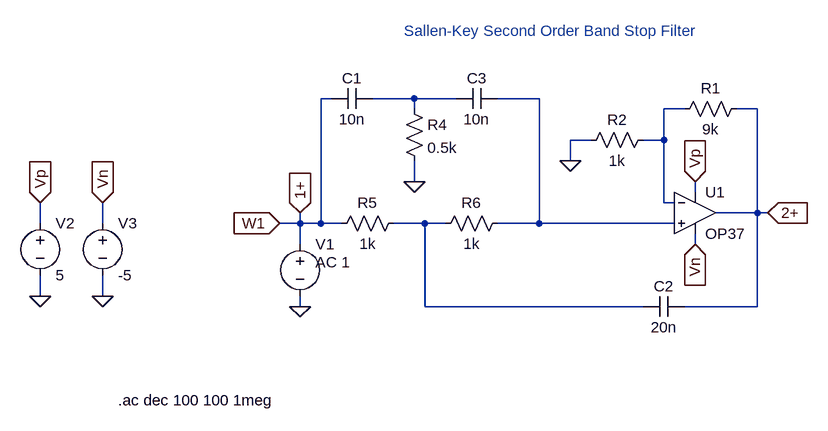
[diagram p0: schematic sk_bsf.asc]
sk_bsf.asc, the LTspice schematic file:
Version 4
SHEET 1 880 680
WIRE -64 -48 -80 -48
WIRE 64 -48 0 -48
WIRE 128 -48 64 -48
WIRE 256 -48 192 -48
WIRE 64 -32 64 -48
WIRE 480 -32 448 -32
WIRE 592 -32 560 -32
WIRE 336 16 304 16
WIRE 448 16 448 -32
WIRE 448 16 416 16
WIRE 304 48 304 16
WIRE 64 80 64 48
WIRE 496 96 496 80
WIRE 448 112 448 16
WIRE 464 112 448 112
WIRE 592 128 592 -32
WIRE 592 128 528 128
WIRE 608 128 592 128
WIRE -512 144 -512 112
WIRE -416 144 -416 112
WIRE -112 144 -112 128
WIRE -112 144 -144 144
WIRE -80 144 -80 -48
WIRE -80 144 -112 144
WIRE -48 144 -80 144
WIRE 80 144 32 144
WIRE 112 144 80 144
WIRE 256 144 256 -48
WIRE 256 144 192 144
WIRE 464 144 256 144
WIRE -112 176 -112 144
WIRE 496 176 496 160
WIRE -512 256 -512 224
WIRE -416 256 -416 224
WIRE -112 272 -112 256
WIRE 80 272 80 144
WIRE 416 272 80 272
WIRE 592 272 592 128
WIRE 592 272 480 272
FLAG 496 80 Vp
IOPIN 496 80 In
FLAG 496 176 Vn
IOPIN 496 176 In
FLAG 608 128 2+
IOPIN 608 128 In
FLAG 304 48 0
FLAG -112 272 0
FLAG -144 144 W1
IOPIN -144 144 In
FLAG -112 128 1+
IOPIN -112 128 In
FLAG -512 256 0
FLAG -416 256 0
FLAG -512 112 Vp
IOPIN -512 112 In
FLAG -416 112 Vn
IOPIN -416 112 In
FLAG 64 80 0
SYMBOL Opamps\\OP37 496 64 R0
SYMATTR InstName U1
SYMBOL res 576 -48 R90
WINDOW 0 0 56 VBottom 2
WINDOW 3 32 56 VTop 2
SYMATTR InstName R1
SYMATTR Value 9k
SYMBOL res 432 0 R90
WINDOW 0 0 56 VBottom 2
WINDOW 3 32 56 VTop 2
SYMATTR InstName R2
SYMATTR Value 1k
SYMBOL voltage -112 160 R0
WINDOW 123 24 44 Left 2
WINDOW 39 0 0 Left 0
SYMATTR Value2 AC 1
SYMATTR InstName V1
SYMATTR Value ""
SYMBOL voltage -512 128 R0
WINDOW 123 0 0 Left 0
WINDOW 39 0 0 Left 0
SYMATTR InstName V2
SYMATTR Value 5
SYMBOL voltage -416 128 R0
WINDOW 123 0 0 Left 0
WINDOW 39 0 0 Left 0
SYMATTR InstName V3
SYMATTR Value -5
SYMBOL res 48 128 R90
WINDOW 0 0 56 VBottom 2
WINDOW 3 32 56 VTop 2
SYMATTR InstName R5
SYMATTR Value 1k
SYMBOL res 208 128 R90
WINDOW 0 0 56 VBottom 2
WINDOW 3 32 56 VTop 2
SYMATTR InstName R6
SYMATTR Value 1k
SYMBOL cap 480 256 R90
WINDOW 0 0 32 VBottom 2
WINDOW 3 32 32 VTop 2
SYMATTR InstName C2
SYMATTR Value 20n
SYMBOL cap 0 -64 R90
WINDOW 0 0 32 VBottom 2
WINDOW 3 32 32 VTop 2
SYMATTR InstName C1
SYMATTR Value 10n
SYMBOL cap 192 -64 R90
WINDOW 0 0 32 VBottom 2
WINDOW 3 32 32 VTop 2
SYMATTR InstName C3
SYMATTR Value 10n
SYMBOL res 48 -48 R0
SYMATTR InstName R4
SYMATTR Value 0.5k
TEXT -392 416 Left 2 !.ac dec 100 100 1meg
TEXT 48 -152 Left 2 ;Sallen-Key Second Order Band Stop Filter

The netlist it stands for:
* sk_bsf.asc
XU1 N002 N003 Vp Vn 2+ LT1037  ; OP37, pins In+ In- V+ V- OUT
R1 2+ N003 9k
R2 N003 0 1k
V1 1+ 0 AC 1
V2 Vp 0 5
V3 Vn 0 -5
R5 N004 1+ 1k
R6 N002 N004 1k
C2 2+ N004 20n
C1 N001 1+ 10n
C3 N002 N001 10n
R4 N001 0 0.5k
.ac dec 100 100 1meg
* Sallen-Key Second Order Band Stop Filter
.lib LTC.lib
.backanno
.end